# Altium schematic sheet USB-C SCH.schdoc
size 124 x 101 mm
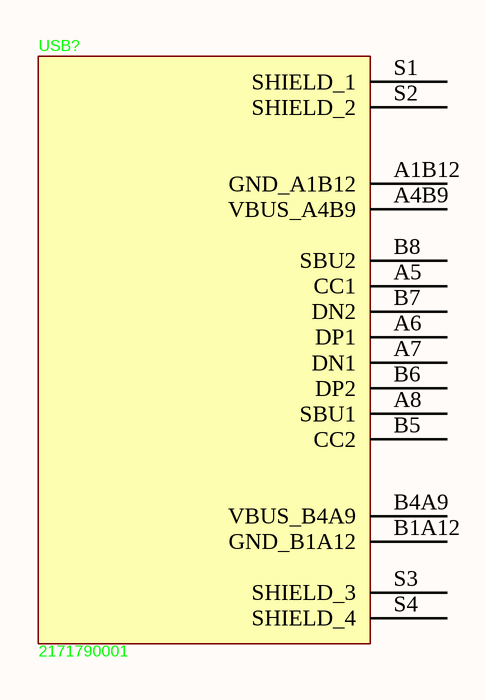
[diagram p0: USB-C SCH.schdoc]

## Parts
USB?  2171790001  [USB-C-SMD_2171790001]

## Nets

Not connected (* = marked no-connect by the designer): USB? A1B12(GND_A1B12) A4B9(VBUS_A4B9) A5(CC1) A6(DP1) A7(DN1) A8(SBU1) B1A12(GND_B1A12) B4A9(VBUS_B4A9) B5(CC2) B6(DP2) B7(DN2) B8(SBU2) S1(SHIELD_1) S2(SHIELD_2) S3(SHIELD_3) S4(SHIELD_4)

## Library data of the parts
USB? = 2171790001: CONN RCP USB2.0 TYP C 24P SMD RA; Manufacturer: MOLEX; Add into BOM: yes; Symbol: 2171790001; Device: 2171790001; LCSC Part Name: 2171790001; Supplier Part: C3197684; Manufacturer Part: 2171790001; Supplier Footprint: SMD; JLCPCB Part Class: Extended Part; Datasheet: https://www.molex.com/content/dam/molex/molex-dot-com/products/automated/en-us/salesdrawingpdf/217/217179/2171790001_sd.pdf?inline\; Supplier: LCSC; Convert to PCB: yes; LCSC Part Number: C3197684